# Altium schematic sheet radfet_supply.SchDoc: Local Supply
size A3; CheckedBy: (not checked); Author: P. Kuligowski
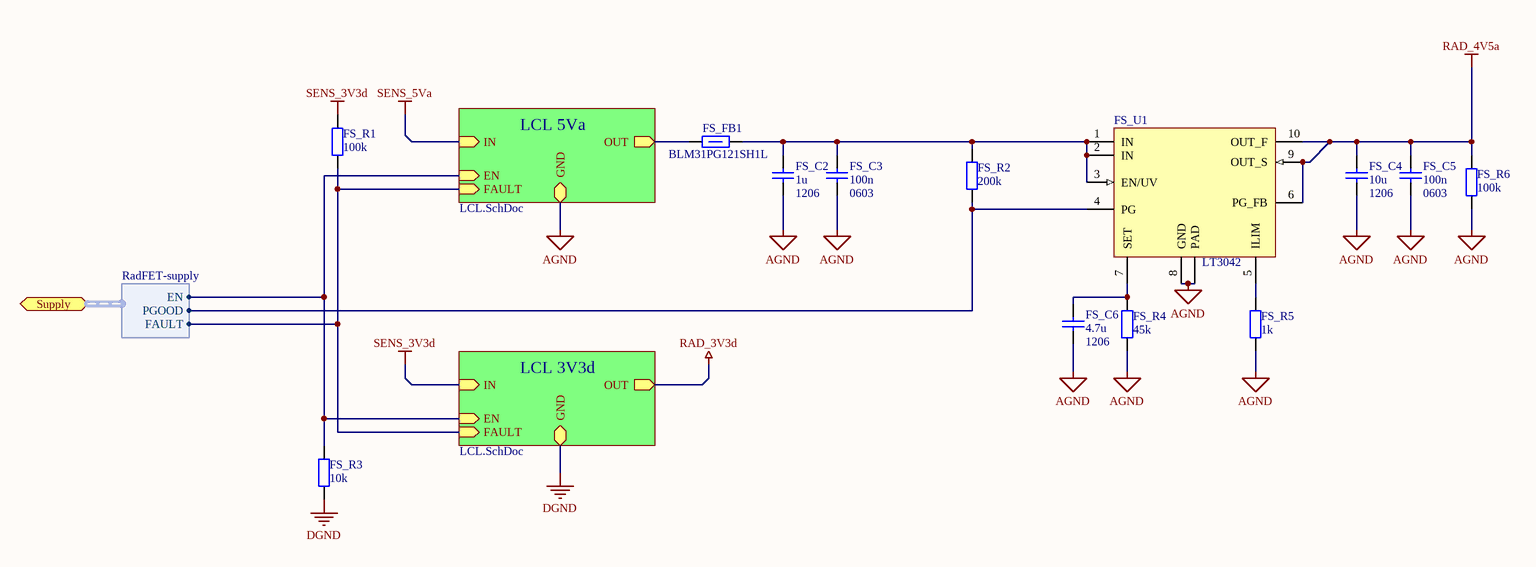
[diagram p0: radfet_supply.SchDoc]

## Parts
FS_C2  value 1u  Package: 1206  [SMD_Capacitor_1206]  (hidden comment: Cap)
FS_C3  value 100n  Package: 0603  [SMD_Capacitor_0603]  (hidden comment: Cap)
FS_C4  value 10u  Package: 1206  [SMD_Capacitor_1206]  (hidden comment: Cap)
FS_C5  value 100n  Package: 0603  [SMD_Capacitor_0603]  (hidden comment: Cap)
FS_C6  value 4.7u  Package: 1206  [SMD_Capacitor_1206]  (hidden comment: Cap)
FS_FB1  120R/100MHz  [SMD_FerriteBead_1206]  (value not drawn)
FS_R1  100k  [SMD_Resistor_0603]
FS_R2  200k  [SMD_Resistor_0603]
FS_R3  10k  [SMD_Resistor_0603]
FS_R4  45k  [SMD_Resistor_0603]
FS_R5  1k  [SMD_Resistor_0603]
FS_R6  100k  [SMD_Resistor_0603]
FS_U1  LT3042  [MSOP-10-M-thermal-pad]

## Sub-sheets
LCL 3V3d = LCL.SchDoc: GND, IN (in), EN (in), OUT (out), FAULT (in)
LCL 5Va = LCL.SchDoc: GND, IN (in), EN (in), OUT (out), FAULT (in)

## Ports
Supply (harness RadFET-supply)

## Harnesses
RadFET-supply: EN, PGOOD, FAULT

## Nets
AGND: FS_C2.2 FS_C3.2 FS_C4.2 FS_C5.2 FS_C6.2 FS_R4.1 FS_R5.1 FS_R6.1 FS_U1.8(GND) FS_U1.11(PAD) ; sheet LCL 5Va/GND
DGND: FS_R3.1 ; sheet LCL 3V3d/GND
RAD_3V3d: sheet LCL 3V3d/OUT
RAD_4V5a: FS_C4.1 FS_C5.1 FS_R6.2 FS_U1.6(PG_FB) FS_U1.9(OUT_S) FS_U1.10(OUT_F)
SENS_3V3d: FS_R1.2 ; sheet LCL 3V3d/IN
SENS_5Va: sheet LCL 5Va/IN
NetFS_C2_1: FS_C2.1 FS_C3.1 FS_FB1.1 FS_R2.1 FS_U1.1(IN) FS_U1.2(IN) FS_U1.3(EN/UV)
NetFS_C6_1: FS_C6.1 FS_R4.2 FS_U1.7(SET)
NetFS_FB1_2: FS_FB1.2 ; sheet LCL 5Va/OUT
NetFS_R1_1: FS_R1.1 ; sheet LCL 5Va/FAULT, sheet LCL 3V3d/FAULT, port Supply.FAULT
NetFS_R2_2: FS_R2.2 FS_U1.4(PG) ; port Supply.PGOOD
NetFS_R3_2: FS_R3.2 ; sheet LCL 5Va/EN, sheet LCL 3V3d/EN, port Supply.EN
NetFS_R5_2: FS_R5.2 FS_U1.5(ILIM)

## Notes on the sheet
- Title:
- Project:
- Author:
- Model:
- Document Number:
- Checked by:
- Rev:
- Date:
- Approved by:
- Sheet:
- of
- File name:

## Library data of the parts
FS_FB1 = BLM31PG121SH1L: Ferrite bead, 1206, 0.02HM, 3.5A.; Manufacturer: Murata; Current Rating: 3.5A; Series Resistance DC: 0.02R; Package: 1206; Value: 120R/100MHz; ManufacturerPartNumber: BLM31PG121SH1L
FS_R1-FS_R6 = Res: Package: 0603
  FS_R1 FS_R6: Value: 100k
  FS_R2: Value: 200k
  FS_R3: Value: 10k
  FS_R4: Value: 45k
  FS_R5: Value: 1k
FS_U1 = LT3042: 20V, 200mA, Ultralow Noise, Ultrahigh PSRR RF Linear Regulator; PartNumber: LT3042; ComponentLink1Description: Manufacturer URL; ComponentLink1URL: http://www.linear.com/; ComponentLink2Description: Datasheet; ComponentLink2URL: http://cds.linear.com/docs/en/datasheet/3042fa.pdf